# Altium schematic sheet teckduino.SchDoc
size A
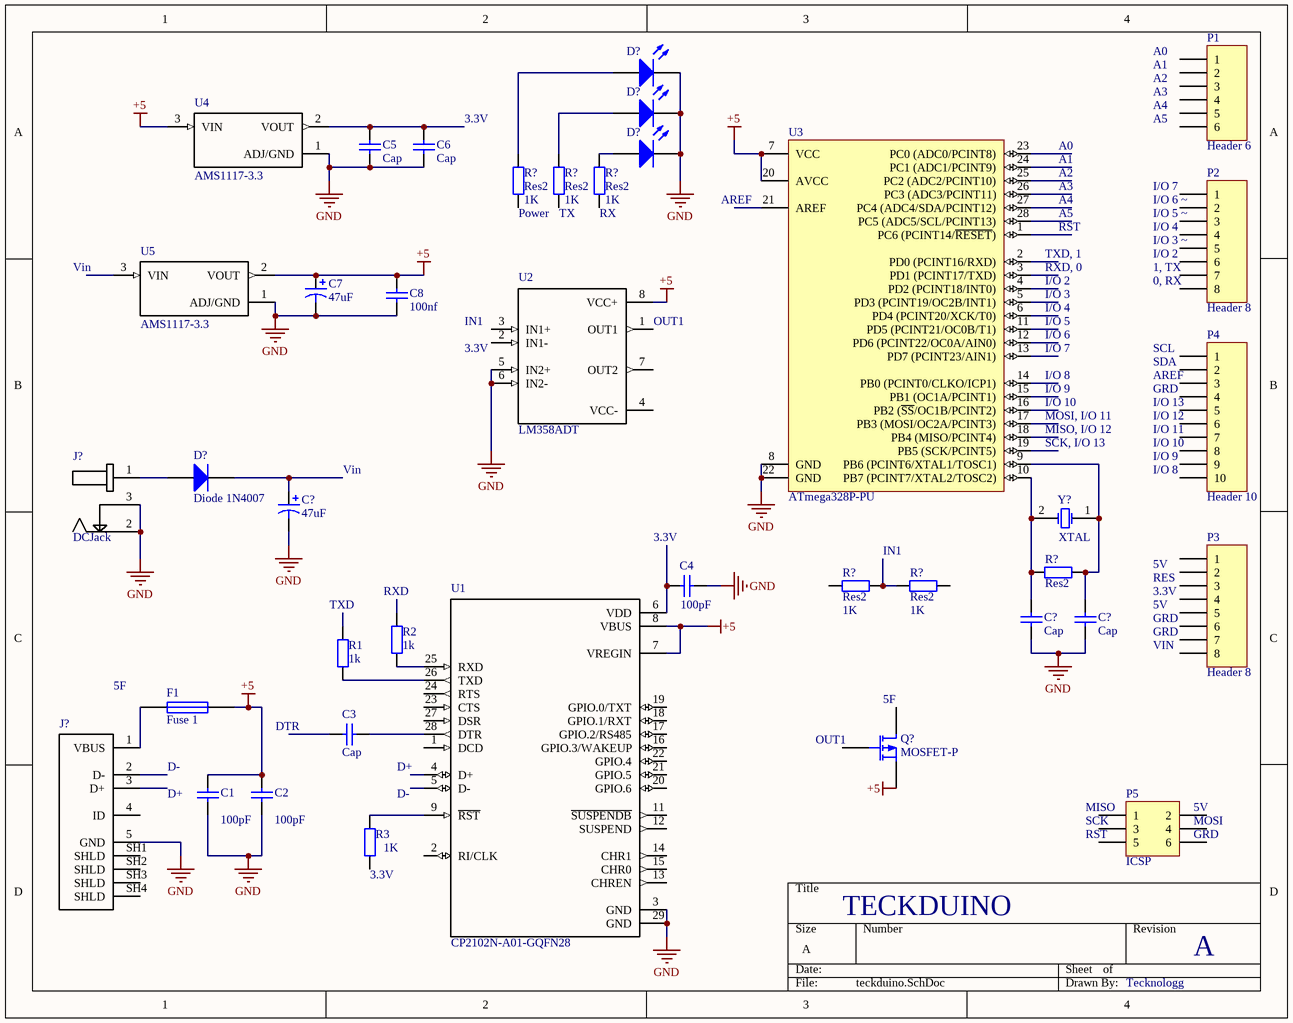
[diagram p0: teckduino.SchDoc]

## Parts
(Parts that share a designator on the sheet are numbered #1, #2 ... from top to bottom, then left to right.)
C1  value 100pF  [RAD-0.3]
C2  value 100pF  [RAD-0.3]
C3  Cap  [RAD-0.3]
C4  value 100pF  [RAD-0.3]
C5  Cap  [RAD-0.3]
C6  Cap  [RAD-0.3]
C7  47uF  [RB7.6-15]
C8  100nf  [RAD-0.3]
C?#1  47uF  [RB7.6-15]
C?#2  Cap  [RAD-0.3]
C?#3  Cap  [RAD-0.3]
D?#1  (no value)  [3.2X1.6X1.1]
D?#2  (no value)  [3.2X1.6X1.1]
D?#3  (no value)  [3.2X1.6X1.1]
D?#4  Diode 1N4007  [DO-41]
F1  Fuse 1  [PIN-W2/E2.8]
J?#1  DCJack  [GCT_DCJ235-05-A-XX-X_REVA]
J?#2  1734035-3  [TE_1734035-3_1734035-3(Primary)]  (value not drawn)
P1  Header 6  [HDR1X6]
P2  Header 8  [HDR1X8]
P3  Header 8  [HDR1X8]
P4  Header 10  [HDR1X10]
P5  ICSP  [HDR2X3]
Q?  MOSFET-P  [E3]
R1  1k  [AXIAL-0.4]
R2  1k  [AXIAL-0.4]
R3  value 1K  [AXIAL-0.4]
R?#1  Res2  value 1K  [AXIAL-0.4]
R?#2  Res2  value 1K  [AXIAL-0.4]
R?#3  Res2  value 1K  [AXIAL-0.4]
R?#4  Res2  [AXIAL-0.4]
R?#5  Res2  value 1K  [AXIAL-0.4]
R?#6  Res2  value 1K  [AXIAL-0.4]
U1  CP2102N-A01-GQFN28  [QFN50P500X500X80-29N]
U2  LM358ADT  [SOIC127P600X175-8N]
U3  ATmega328P-PU  [28P3]
U4  AMS1117-3.3  [SOT229P700X180-4N]
U5  AMS1117-3.3  [SOT229P700X180-4N]
Y?  XTAL  [R38]

## Nets
+5: C1.2 C2.2 C7.1 C8.2 F1.2 Q?.3(S) U1.7(VREGIN) U1.8(VBUS) U2.8(VCC+) U3.7(VCC) U3.20(AVCC) U4.3(VIN) U5.2(VOUT)
GND: C1.1 C2.1 C4.2 C5.1 C6.1 C7.2 C8.1 C?#1.2 C?#2.1 C?#3.1 D?#1.2(K) D?#2.2(K) D?#3.2(K) J?#1.2 J?#1.3 J?#2.5(GND) U1.3(GND) U1.29(GND) U2.5(IN2+) U2.6(IN2-) U3.8(GND) U3.22(GND) U4.1(ADJ/GND) U5.1(ADJ/GND)
NetC3_1: C3.1 U1.28(DTR)
NetC4_1: C4.1 U1.6(VDD)
NetC5_2: C5.2 C6.2 U4.2(VOUT)
NetC?#1_1: C?#1.1 D?#4.2(K)
NetC?#2_2: C?#2.2 R?#4.1 U3.10(PB7_(PCINT7/XTAL2/TOSC2)) Y?.2(OSC2)
NetC?#3_2: C?#3.2 R?#4.2 U3.9(PB6_(PCINT6/XTAL1/TOSC1)) Y?.1(OSC1)
NetD?#1_1: D?#1.1(A) R?#1.2
NetD?#2_1: D?#2.1(A) R?#2.2
NetD?#3_1: D?#3.1(A) R?#3.2
NetD?#4_1: D?#4.1(A) J?#1.1
NetF1_1: F1.1 J?#2.1(VBUS)
NetR1_1: R1.1 U1.26(TXD)
NetR2_1: R2.1 U1.25(RXD)
NetR3_2: R3.2 U1.9(~{RST})
NetR?#5_2: R?#5.2 R?#6.1

Not connected (* = marked no-connect by the designer): C3 2; J?#2 2(D-) 3(D+) 4(ID) SH1(SHLD) SH2(SHLD) SH3(SHLD) SH4(SHLD); P1 1 2 3 4 5 6; P2 1 2 3 4 5 6 7 8; P3 1 2 3 4 5 6 7 8; P4 1 2 3 4 5 6 7 8 9 10; P5 1 2 3 4 5 6; Q? 1(D) 2(G); R1 2; R2 2; R3 1; R?#1 1; R?#2 1; R?#3 1; R?#5 1; R?#6 2; U1 1(DCD) 2(RI/CLK) 4(D+) 5(D-) 11(~{SUSPENDB}) 12(SUSPEND) 13(CHREN) 14(CHR1) 15(CHR0) 16(GPIO.3/WAKEUP) 17(GPIO.2/RS485) 18(GPIO.1/RXT) 19(GPIO.0/TXT) 20(GPIO.6) 21(GPIO.5) 22(GPIO.4) 23(CTS) 24(RTS) 27(DSR); U2 1(OUT1) 2(IN1-) 3(IN1+) 4(VCC-) 7(OUT2); U3 1(PC6_(PCINT14/~{RESET})) 2(PD0_(PCINT16/RXD)) 3(PD1_(PCINT17/TXD)) 4(PD2_(PCINT18/INT0)) 5(PD3_(PCINT19/OC2B/INT1)) 6(PD4_(PCINT20/XCK/T0)) 11(PD5_(PCINT21/OC0B/T1)) 12(PD6_(PCINT22/OC0A/AIN0)) 13(PD7_(PCINT23/AIN1)) 14(PB0_(PCINT0/CLKO/ICP1)) 15(PB1_(OC1A/PCINT1)) 16(PB2_(~{SS}/OC1B/PCINT2)) 17(PB3_(MOSI/OC2A/PCINT3)) 18(PB4_(MISO/PCINT4)) 19(PB5_(SCK/PCINT5)) 21(AREF) 23(PC0_(ADC0/PCINT8)) 24(PC1_(ADC1/PCINT9)) 25(PC2_(ADC2/PCINT10)) 26(PC3_(ADC3/PCINT11)) 27(PC4_(ADC4/SDA/PCINT12)) 28(PC5_(ADC5/SCL/PCINT13)); U5 3(VIN)

## Notes on the sheet
- (near P1) A0
- (near P1) A1
- (near P1) A2
- (near P1) A3
- 3.3V
- A0
- A1
- (near P1) A4
- (near P1) A5
- (near R?#1) Power
- (near R?#2) TX
- (near R?#3) RX
- (near U3) AREF
- A2
- A3
- A4
- A5
- RST
- (near P2) I/O 7
- (near P2) I/O 6 ~
- (near P2) I/O 5 ~
- (near P2) I/O 4
- (near U5) Vin
- (near U3) RXD, 0
- (near U3) TXD, 1
- (near U3) I/O 2
- (near U3) I/O 3
- (near P2) I/O 3 ~
- (near P2) I/O 2
- (near P2) 1, TX
- (near P2) 0, RX
- (near U2) 3.3V
- (near U2) IN1
- (near U2) OUT1
- (near U3) I/O 4
- (near U3) I/O 5
- (near U3) I/O 6
- (near U3) I/O 7
- (near P4) SCL
- (near P4) SDA
- (near U3) MISO, I/O 12
- (near U3) MOSI, I/O 11
- (near U3) I/O 8
- (near U3) I/O 9
- (near U3) I/O 10
- (near P4) AREF
- (near P4) GRD
- (near P4) I/O 13
- (near P4) I/O 12
- (near P4) I/O 11
- Vin
- (near U3) SCK, I/O 13
- (near P4) I/O 10
- (near P4) I/O 9
- (near P4) I/O 8
- (near C4) 3.3V
- (near R?#6) IN1
- (near P3) 5V
- (near R1) TXD
- (near R2) RXD
- (near P3) RES
- (near P3) 3.3V
- (near P3) GRD
- 5F
- (near Q?) 5F
- (near P3) VIN
- (near C1) D-
- DTR
- D+
- (near Q?) OUT1
- (near C1) D+
- D-
- (near P5) MISO
- (near P5) SCK
- (near P5) RST
- (near P5) 5V
- (near P5) MOSI
- (near P5) GRD
- (near R3) 3.3V
- TECKDUINO
- A
- Tecknologg

## Library data of the parts
C1-C6 C8 C?#2 C?#3 = Cap: Capacitor; Published: 8-Jun-2000; LatestRevisionDate: 17-Jul-2002; LatestRevisionNote: Re-released for DXP Platform.; PackageReference: RAD-0.3; Publisher: Altium Limited; PackageDescription: Radial Cap, Thru-Hole; 2 Leads; 0.3 in Pin Spacing
C7 C?#1 = Cap Pol1: Polarized Capacitor (Radial); Published: 8-Jun-2000; LatestRevisionDate: 17-Jul-2002; LatestRevisionNote: Re-released for DXP Platform.; PackageReference: RB7.6-15; Publisher: Altium Limited; PackageDescription: Polarized Capacitor (Radial); 2 Leads
D?#1-D?#3 = LED2: Typical RED, GREEN, YELLOW, AMBER GaAs LED; Published: 8-Jun-2000; LatestRevisionDate: 17-Jul-2002; LatestRevisionNote: Re-released for DXP Platform.; PackageVersion: Feb-2002; PackageReference: 3.2X1.6X1.1; Publisher: Altium Limited; PackageDescription: SM LED; 2 Flat Leads
D?#4 = Diode 1N4007: 1 Amp General Purpose Rectifier; Published: 8-Jun-2000; LatestRevisionDate: 17-Jul-2002; LatestRevisionNote: Re-released for DXP Platform.; DatasheetVersion: 1998; PackageVersion: Aug-1999; PackageReference: DO-41; Publisher: Altium Limited; PackageDescription: Diode, Axial; Body 5.2 x 2.7 mm (LxDia. max), Lead Dia. 0.86 mm (max); Code_JEDEC: DO-204-AL; ComponentLink1Description: Manufacturer Link; ComponentLink1URL: http://www.fairchildsemi.com/; ComponentLink2Description: Datasheet; ComponentLink2URL: http://www.fairchildsemi.com/ds/1N%2F1N4001.pdf
F1 = Fuse 1: Fuse; Published: 8-Jun-2000; LatestRevisionDate: 17-Jul-2002; LatestRevisionNote: Re-released for DXP Platform.; PackageReference: PIN-W2/E2.8; Publisher: Altium Limited; PackageDescription: Thru-Hole; 2 Leads
J?#1 = DCJ235-05-A-XX-X_REVA: Dc Power Jack, 5a, 20vdc, Black; MP: DCJ235-05-A-K1-A; MF: Global Connector Technology; Package: None; SnapEDA_Link: https://www.snapeda.com/parts/DCJ235-05-A-K1-A/Global%20Connector%20Technology/view-part/?ref=snap; Availability: Unavailable; Price: None; Value: *
J?#2 = 1734035-3: Conn Mini USB 2.0 Type B RCP 5 POS 0.8mm Solder RA SMD 5 Terminal 1 Port T/R; MF: TE Connectivity; MP: 1734035-3; Package: None; TE_purchase_URL: https://www.te.com/usa-en/product-1734035-3.html?te_bu=Cor&te_type=disp&te_campaign=seda_glo_cor-seda-global-disp-prtnr-fy19-seda-model-bom-cta_sma-317_1&elqCampaignId=32493; Availability: Unavailable; Price: None; SnapEDA_Link: https://www.snapeda.com/parts/1734035-3/TE%20Connectivity%20AMP%20Connectors/view-part/?ref=snap; Value: *
P1 = Header 6: Header, 6-Pin; LatestRevisionDate: 17-Jul-2002; LatestRevisionNote: Re-released for DXP Platform.; Publisher: Altium Limited
P2 P3 = Header 8: Header, 8-Pin; LatestRevisionDate: 17-Jul-2002; LatestRevisionNote: Re-released for DXP Platform.; Publisher: Altium Limited
P4 = Header 10: Header, 10-Pin; LatestRevisionDate: 17-Jul-2002; LatestRevisionNote: Re-released for DXP Platform.; Publisher: Altium Limited
P5 = Header 3X2: Header, 3-Pin, Dual row; LatestRevisionDate: 17-Jul-2002; LatestRevisionNote: Re-released for DXP Platform.; Publisher: Altium Limited
Q? = MOSFET-P: P-Channel MOSFET; Published: 8-Jun-2000; LatestRevisionDate: 17-Jul-2002; LatestRevisionNote: Re-released for DXP Platform.; PackageVersion: 1995/1996; PackageReference: E3; Publisher: Altium Limited; PackageDescription: TO, Flat Index; 3 In-Line, Axial Leads; Body Dia. 4.6mm; Lead Dia. 0.5 mm (max)
R1-R3 R?#1-R?#6 = Res2: Resistor; Published: 8-Jun-2000; LatestRevisionDate: 17-Jul-2002; LatestRevisionNote: Re-released for DXP Platform.; PackageReference: AXIAL-0.4; Publisher: Altium Limited; PackageDescription: Axial Device, Thru-Hole; 2 Leads; 0.4 in Pin Spacing
U1 = CP2102N-A01-GQFN28: Usb-Uart Interface Bridge, Qfn-28; MF: Silicon Labs; Package: QFN-28 Silicon Labs; Availability: Unavailable; SnapEDA_Link: https://www.snapeda.com/parts/CP2102N-A01-GQFN28/Silicon%20Labs/view-part/?ref=snap; MP: CP2102N-A01-GQFN28; Price: None; Value: *
U2 = LM358ADT: LM358 Series 30 V 1.1 MHz Low Power Dual Operational Amplifier - SOIC-8; MF: STMicroelectronics; MP: LM358ADT; Price: None; Availability: Unavailable; SnapEDA_Link: https://www.snapeda.com/parts/LM358ADT/STMicroelectronics/view-part/?ref=snap; Package: SOIC-8 STMicroelectronics; Value: *
U3 = ATmega328P-PU: 8-bit AVR Microcontroller, 32KB Flash, 1KB EEPROM, 2KB SRAM, 28-pin PDIP, Industrial Grade (-40°C to 85°C); Published: 1-Apr-2010; DatasheetVersion: revA, Jan-2010; PackageVersion: revB, Sep-2001; PackageReference: 28P3; Publisher: Altium Limited; PackageDescription: 28-lead (0.300"/7.62mm Wide) Plastic Dual Inline Package (PDIP); Supplier 1: Digi-Key; Supplier Part Number 1: ATMEGA328P-PU-ND; Supplier 2: Farnell; Supplier Part Number 2: 1715487; Supplier 3: Mouser; Supplier Part Number 3: 556-ATMEGA328P-PU; ComponentLink1Description: Manufacturer Link; ComponentLink1URL: http://www.atmel.com/products/avr/default.asp?; ComponentLink2Description: ATmega48A/48PA/88A/88PA/168A/168PA/328/328P Datasheet; ComponentLink2URL: http://www.atmel.com/dyn/resources/prod_documents/8271.pdf; ComponentLink3Description: ATmega48A/48PA/88A/88PA/168A/168PA/328/328P Summary; ComponentLink3URL: http://www.atmel.com/dyn/resources/prod_documents/8271S.pdf; ComponentLink4Description: Atmel.com Home; ComponentLink4URL: http://www.atmel.com
U4 U5 = AMS1117-3.3: Sot223/Pkg 1-Amp 3.3-Volt Low Drop Out Voltage Regulatator; MF: Advanced Monolithic Systems; MP: AMS1117-3.3; Package: None; Availability: Unavailable; Price: None; SnapEDA_Link: https://www.snapeda.com/parts/AMS1117-3.3/Advanced%20Monolithic%20Systems/view-part/?ref=snap; Value: *
Y? = XTAL: Crystal Oscillator; Published: 8-Jun-2000; LatestRevisionDate: 17-Jul-2002; LatestRevisionNote: Re-released for DXP Platform.; PackageReference: R38; Publisher: Altium Limited; PackageDescription: Crystal, Thru-Hole; 2 Leads; Body 3.1 x 8.2 mm (Dia.xH)